# EAGLE design HeatBedRelay5D_int (EAGLE 8.2.2)
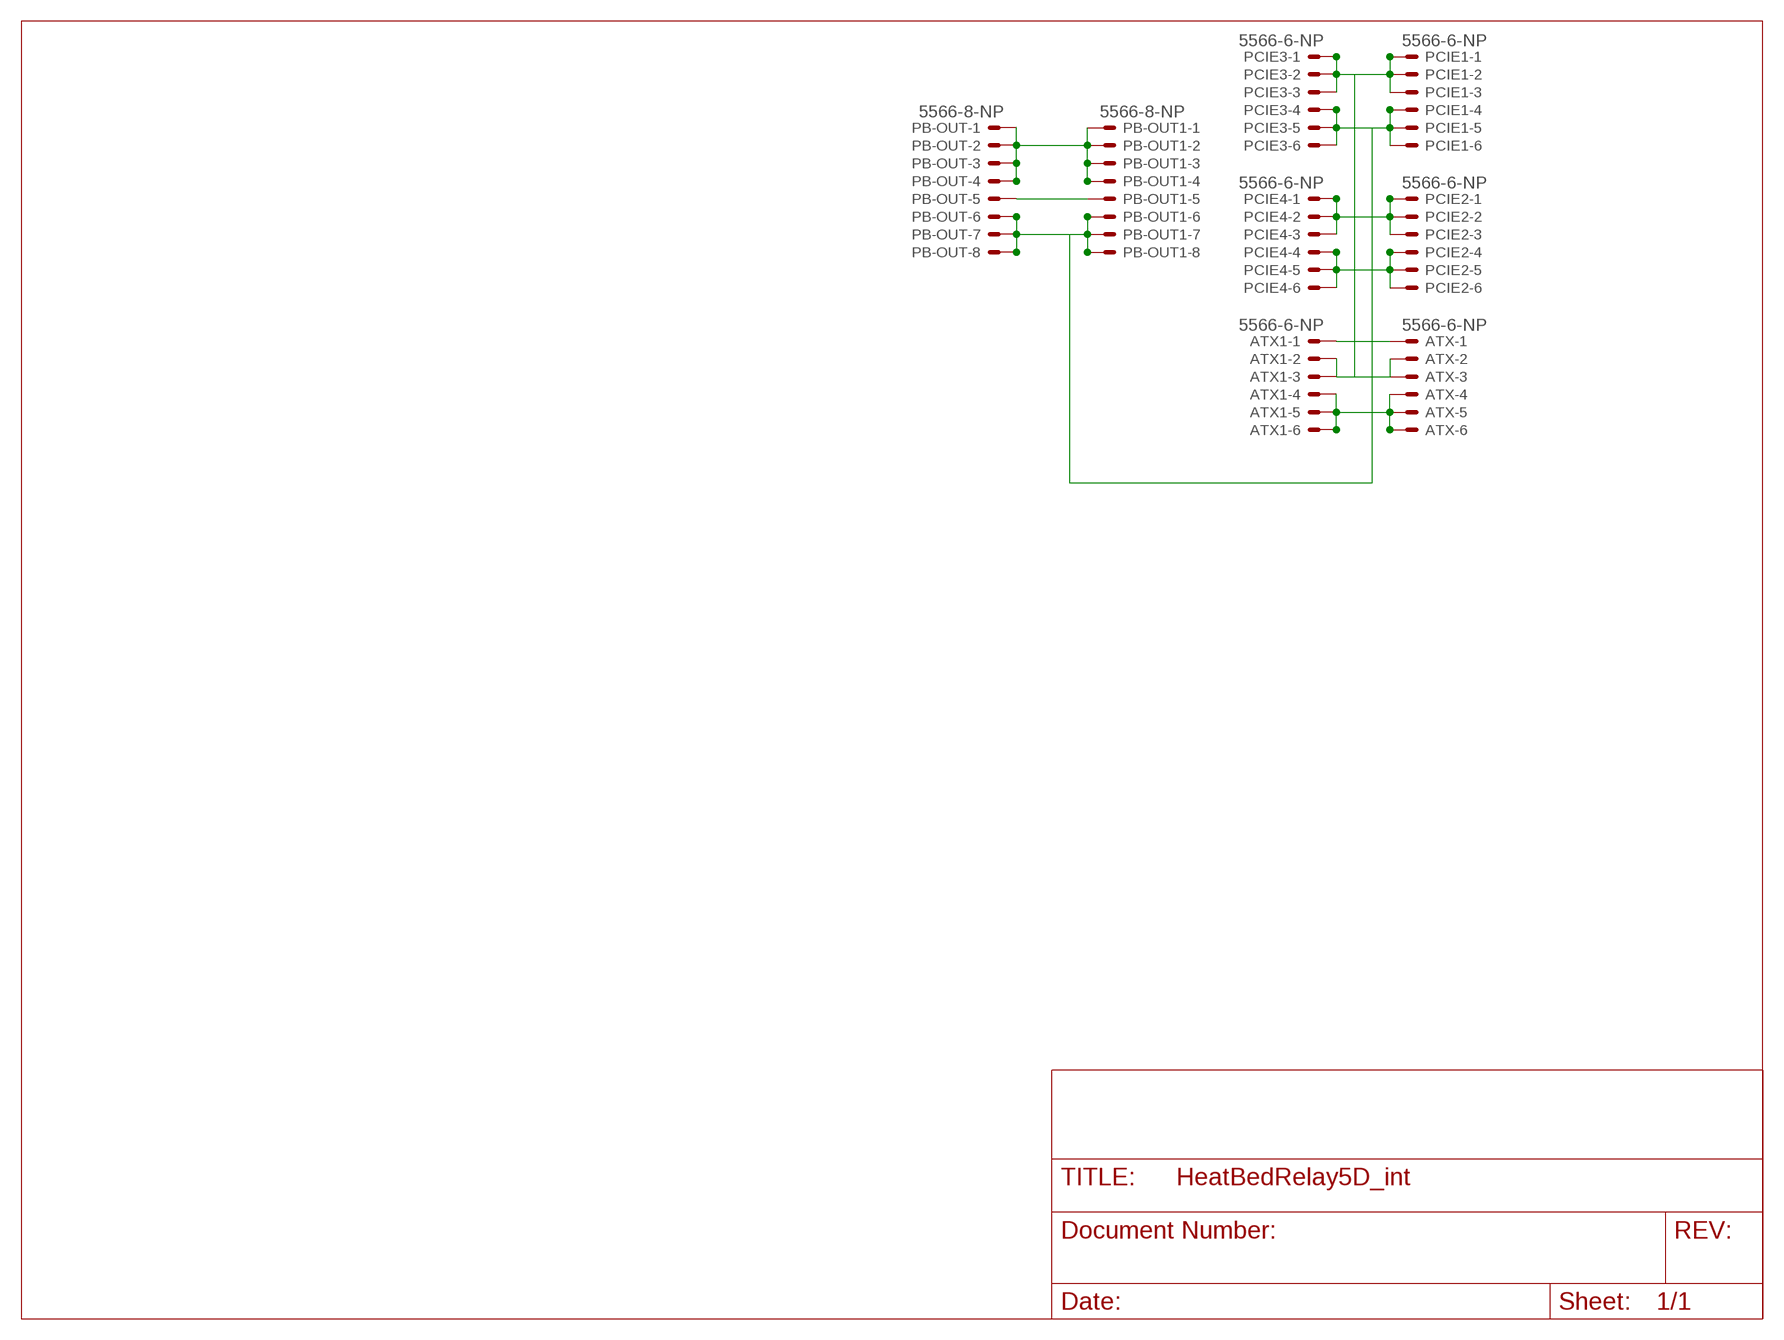
[diagram p0: schematic, sheet 1]

## Parts
ATX  5566-6-NP  [5566-6-NP]
ATX1  5566-6-NP  [5566-6-NP]
PB-OUT  5566-8-NP  [5566-8-NP]
PB-OUT1  5566-8-NP  [5566-8-NP]
PCIE1  5566-6-NP  [5566-6-NP]
PCIE2  5566-6-NP  [5566-6-NP]
PCIE3  5566-6-NP  [5566-6-NP]
PCIE4  5566-6-NP  [5566-6-NP]

## Nets
12V: ATX1.2 ATX1.3 ATX.2 ATX.3 PCIE1.1 PCIE1.2 PCIE1.3 PCIE2.1 PCIE2.2 PCIE2.3 PCIE3.1 PCIE3.2 PCIE3.3 PCIE4.1 PCIE4.2 PCIE4.3
ATX_PWR_SW: ATX1.1 ATX.1
GND: ATX1.4 ATX1.5 ATX1.6 ATX.4 ATX.5 ATX.6 PB-OUT1.6 PB-OUT1.7 PB-OUT1.8 PB-OUT.6 PB-OUT.7 PB-OUT.8 PCIE1.4 PCIE1.5 PCIE1.6 PCIE2.4 PCIE2.5 PCIE2.6 PCIE3.4 PCIE3.5 PCIE3.6 PCIE4.4 PCIE4.5 PCIE4.6
PB_HB_ON: PB-OUT1.5 PB-OUT.5
PB_PWR: PB-OUT1.1 PB-OUT1.2 PB-OUT1.3 PB-OUT1.4 PB-OUT.1 PB-OUT.2 PB-OUT.3 PB-OUT.4

## Library data of the parts
ATX ATX1 PCIE1-PCIE4 = Shipman:5566-6-NP: Mini FIT connector 6 pol Source: http://www.molex.com
PB-OUT PB-OUT1 = Shipman:5566-8-NP: Mini FIT connector 8 pol Source: http://www.molex.com

## Board
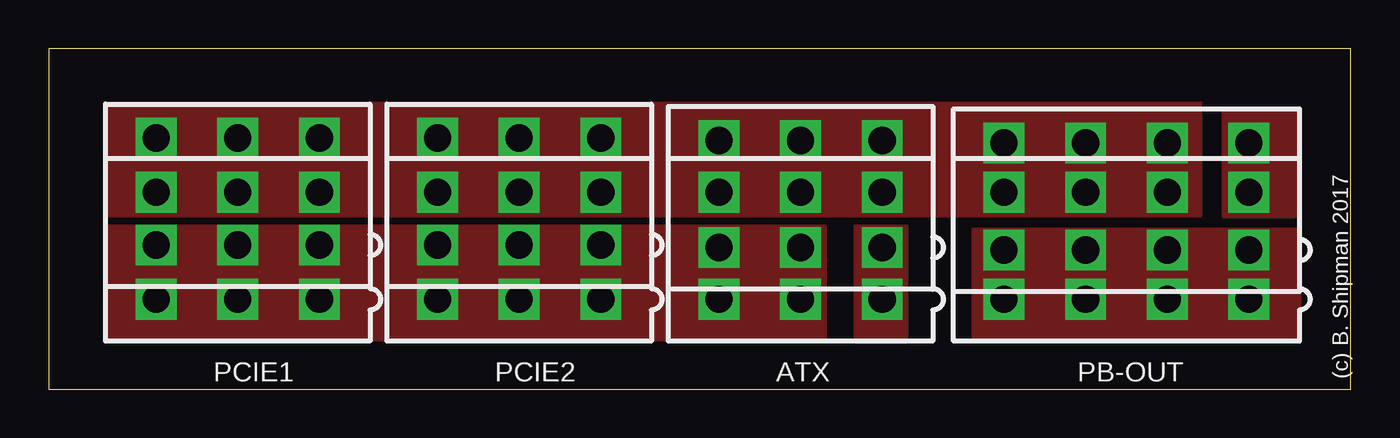
[diagram p1: board, top side]
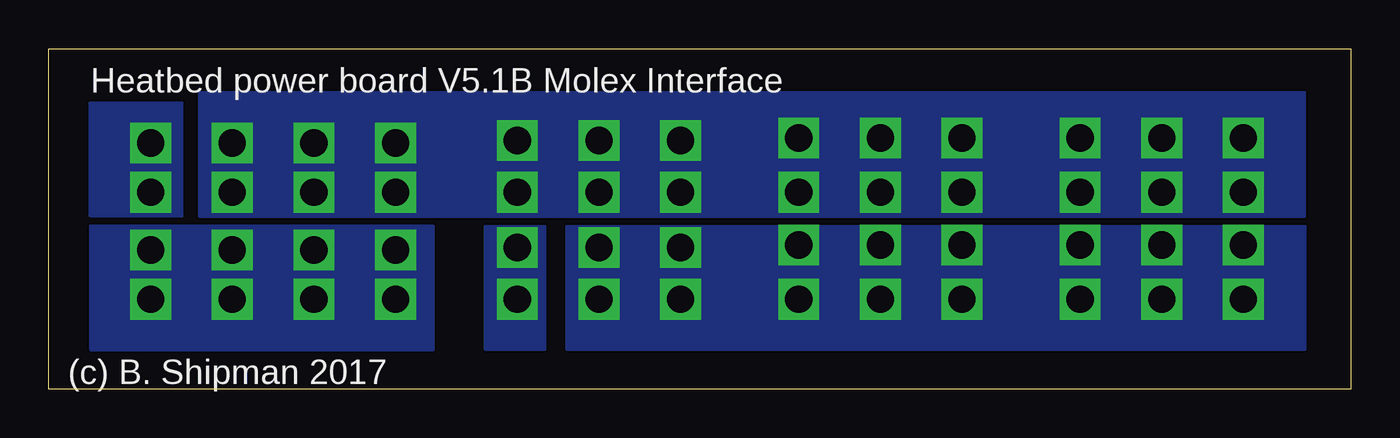
[diagram p2: board, bottom side, seen from below]

Size 67 x 17.51 mm. Coordinates in mm from the lower left corner, seen from the top.
Outline: 0,0 67,0 67,17.51 0.01,17.51 0,0
Copper layers (1*16): Top 0.035mm / dielectric 1.5mm / Bottom 0.035mm
Design rules "default *": minimum track width 10mil, minimum drill 0.35mm, track to track 6mil, track to pad 6mil, pad to pad 6mil, via to via 6mil, smd to smd 6mil, copper to edge 40mil, drill to drill 6mil, minimum pad ring 10mil, minimum via ring 8mil, stop-mask expansion 4mil, vias tented up to drill 0mil, thermal gap 10mil

### Footprints (pad centres in the part's own frame; a part is rotated, then mirrored left to right if it is on the bottom)
5566-6-NP = drill 1.4 square: 1 4.2,-2.75; 2 0,-2.75; 3 -4.2,-2.75; 4 4.2,2.75; 5 0,2.75; 6 -4.2,2.75
5566-8-NP = drill 1.4 square: 1 6.3,-2.75; 2 2.1,-2.75; 3 -2.1,-2.75; 4 -6.3,-2.75; 5 6.3,2.75; 6 2.1,2.75; 7 -2.1,2.75; 8 -6.3,2.75

### Placement (x,y rotation side)
ATX  38.69,7.37 0 top
ATX1  38.69,10.04 0 top
PB-OUT  55.45,7.37 0 top
PB-OUT1  55.45,9.91 0 top
PCIE1  9.73,7.37 0 top
PCIE2  24.21,7.37 0 top
PCIE3  9.73,10.16 0 top
PCIE4  24.21,10.16 0 top

### Tracks (layer width: path | path; a pad name or v marks a point on that pad's centre or on a via)
12V
  pour Top (no thermals): 2.88,2.54 39.96,2.54 39.96,8.39 2.88,8.39
  pour Bottom (no thermals): 2.37,2.04 40.34,2.04 40.34,8.39 2.37,8.39
ATX_PWR_SW
  pour Bottom (no thermals): 41.48,2.04 44.53,2.04 44.53,8.39 41.48,8.39
  pour Top (no thermals): 44.15,8.39 41.48,8.39 41.48,2.42 44.15,2.42
GND
  pour Top (no thermals): 2.88,14.74 59.26,14.74 59.26,8.89 2.88,8.89
  pour Bottom (no thermals): 2.37,15.24 59.26,15.24 59.26,8.89 2.37,8.89
PB_HB_ON
  pour Top (no thermals): 60.41,8.89 64.34,8.89 64.34,14.23 60.41,14.23
  pour Bottom (no thermals): 64.85,14.74 60.15,14.74 60.15,8.89 64.85,8.89
PB_PWR
  pour Top (no thermals): 64.34,2.54 47.58,2.54 47.58,8.26 64.34,8.26
  pour Bottom (no thermals): 64.85,2.04 47.2,2.04 47.2,8.39 64.85,8.39

### Text on the board
tPlace: (c) B. Shipman 2017
bPlace: Heatbed power board V5.1B Molex Interface | (c) B. Shipman 2017